# Altium schematic sheet 07_LMS7002M_1_Power.SchDoc: LMS7002M #1 power supply
size A3 portrait; Organization: Lime Microsystems; Address1: Surrey Tech Centre; Address2: Guildford GU2 7YG; Address3: Surrey; Address4: United Kingdom; Revision: v1.2; SheetNumber: 7; SheetTotal: 27; PageSetup: Record=PageOptions|CenterHorizontal=True|CenterVertical=True|PrintScale=0.70|XCorrection=1.00|YCorrection=1.00|PrintKind=1|BorderSize=5000000|LeftOffset=0|BottomOffset=0|Orientation=1|PaperLength=2970|PaperWidth=2100|Scale=100|PaperSource=7|PrintQuality=600|MediaType=1|DitherType=10|PrintScaleMode=1|PaperKind=A4|PaperIndex=9
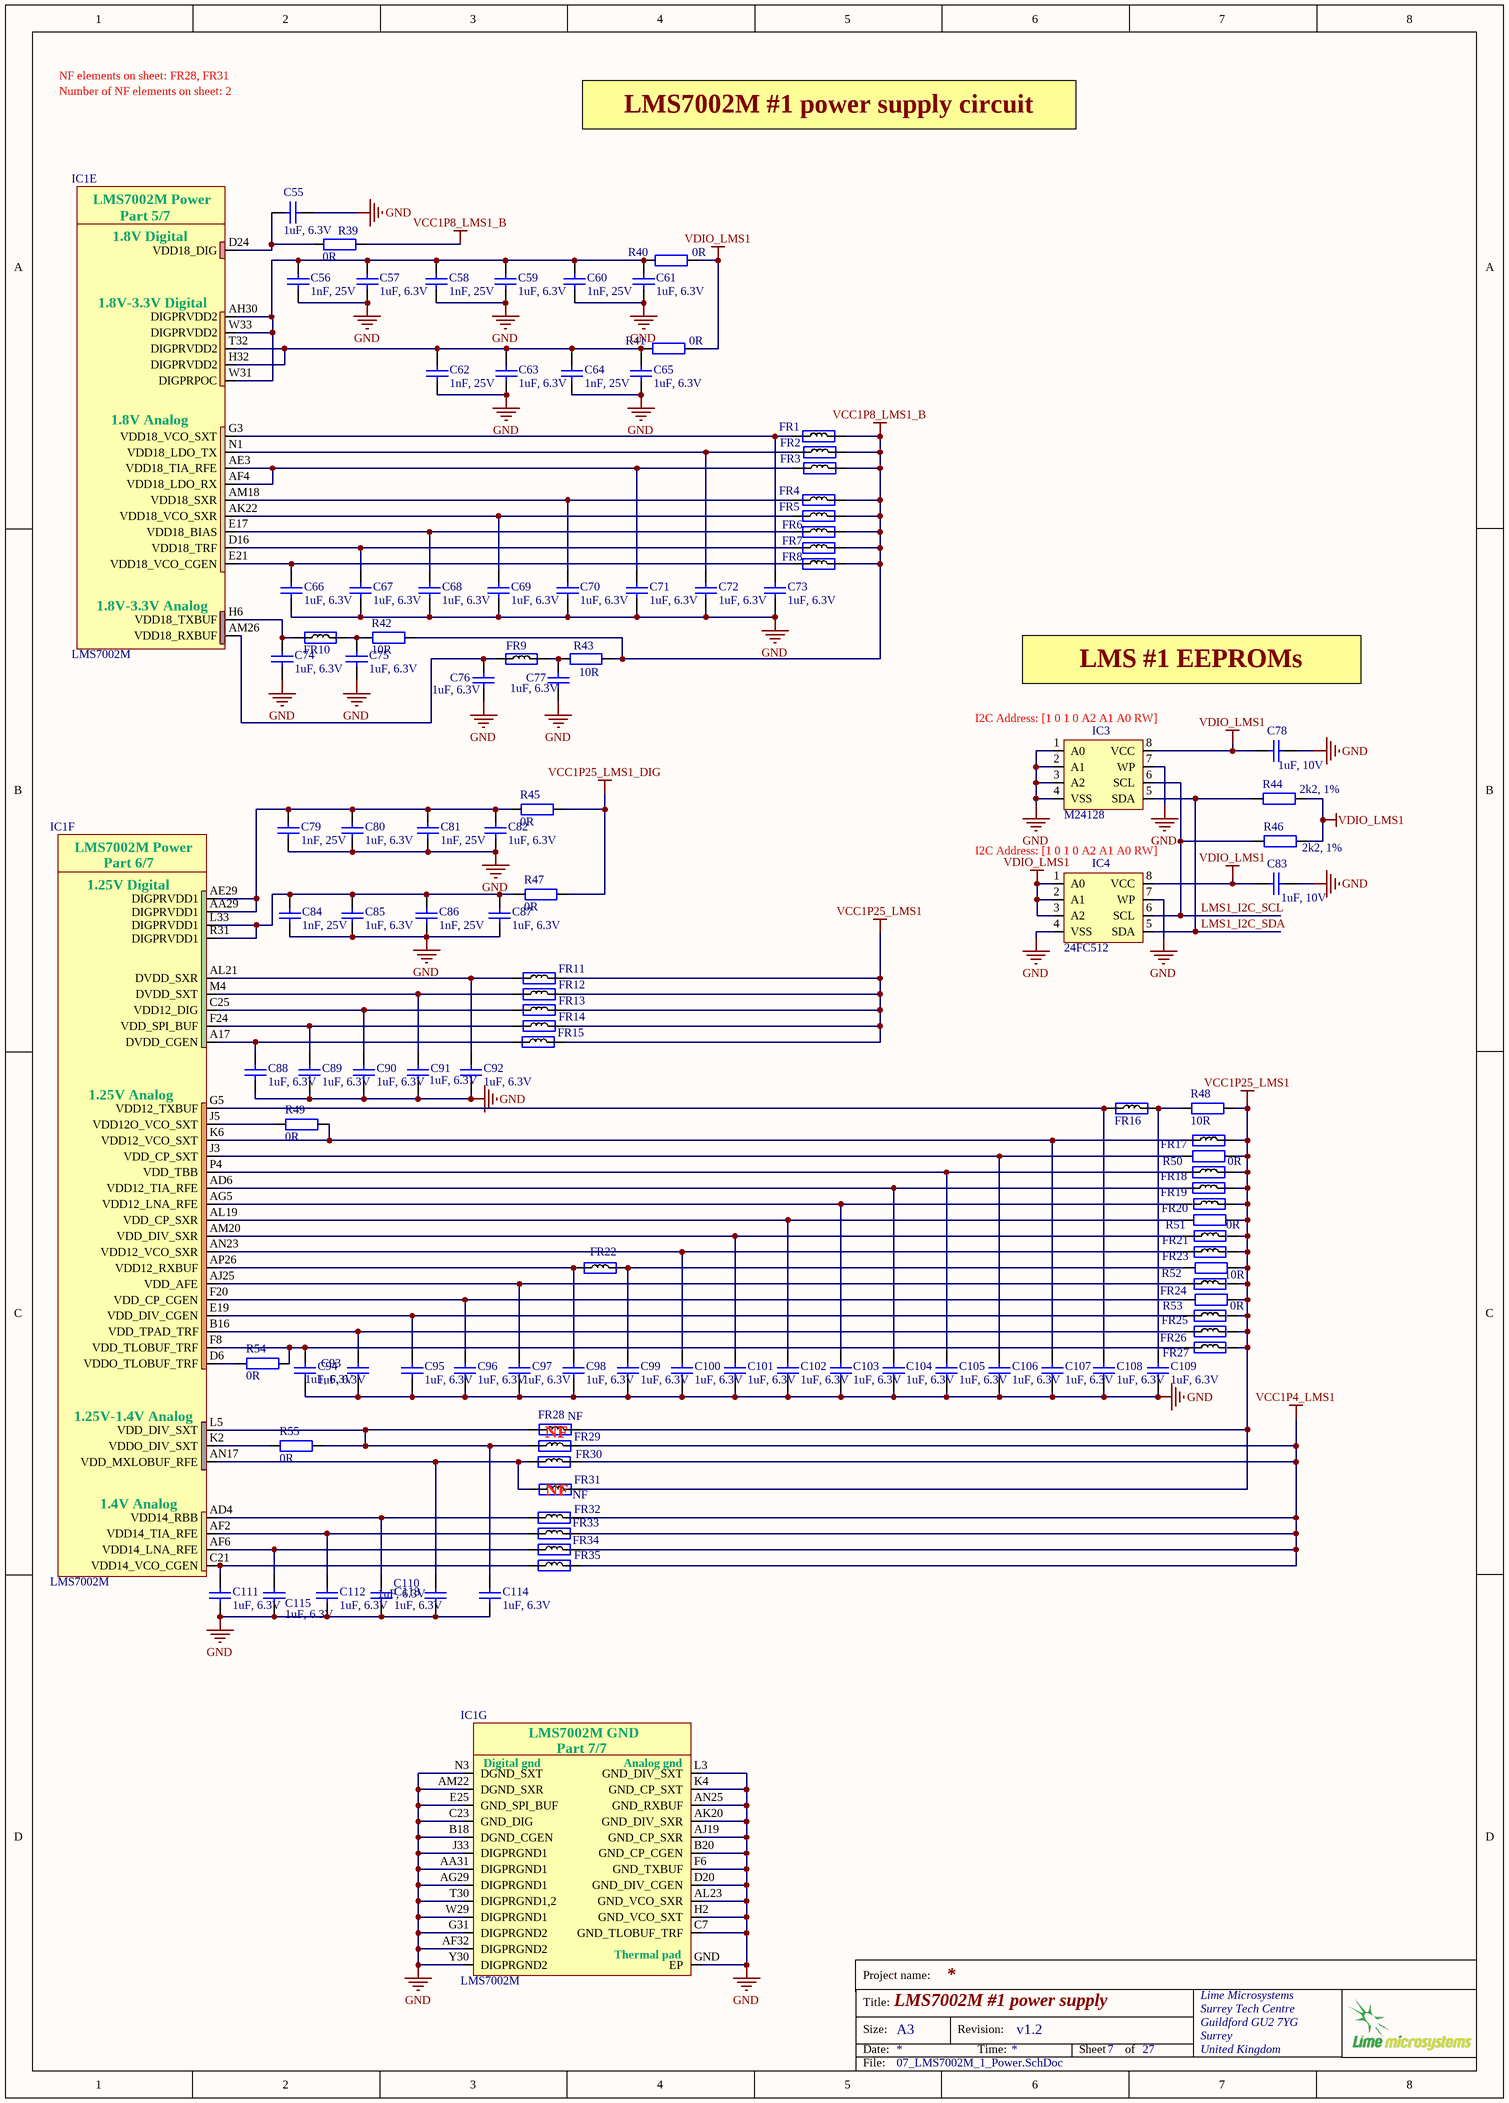
[diagram p0: 07_LMS7002M_1_Power.SchDoc]

## Parts
C55  1uF, 6.3V  [CAP0201]
C56  1nF, 25V  [CAP0201]
C57  1uF, 6.3V  [CAP0201]
C58  1nF, 25V  [CAP0201]
C59  1uF, 6.3V  [CAP0201]
C60  1nF, 25V  [CAP0201]
C61  1uF, 6.3V  [CAP0201]
C62  1nF, 25V  [CAP0201]
C63  1uF, 6.3V  [CAP0201]
C64  1nF, 25V  [CAP0201]
C65  1uF, 6.3V  [CAP0201]
C66  1uF, 6.3V  [CAP0201]
C67  1uF, 6.3V  [CAP0201]
C68  1uF, 6.3V  [CAP0201]
C69  1uF, 6.3V  [CAP0201]
C70  1uF, 6.3V  [CAP0201]
C71  1uF, 6.3V  [CAP0201]
C72  1uF, 6.3V  [CAP0201]
C73  1uF, 6.3V  [CAP0201]
C74  1uF, 6.3V  [CAP0201]
C75  1uF, 6.3V  [CAP0201]
C76  1uF, 6.3V  [CAP0201]
C77  1uF, 6.3V  [CAP0201]
C78  1uF, 10V  [CAP0402]
C79  1nF, 25V  [CAP0201]
C80  1uF, 6.3V  [CAP0201]
C81  1nF, 25V  [CAP0201]
C82  1uF, 6.3V  [CAP0201]
C83  1uF, 10V  [CAP0402]
C84  1nF, 25V  [CAP0201]
C85  1uF, 6.3V  [CAP0201]
C86  1nF, 25V  [CAP0201]
C87  1uF, 6.3V  [CAP0201]
C88  1uF, 6.3V  [CAP0201]
C89  1uF, 6.3V  [CAP0201]
C90  1uF, 6.3V  [CAP0201]
C91  1uF, 6.3V  [CAP0201]
C92  1uF, 6.3V  [CAP0201]
C93  1uF, 6.3V  [CAP0201]
C94  1uF, 6.3V  [CAP0201]
C95  1uF, 6.3V  [CAP0201]
C96  1uF, 6.3V  [CAP0201]
C97  1uF, 6.3V  [CAP0201]
C98  1uF, 6.3V  [CAP0201]
C99  1uF, 6.3V  [CAP0201]
C100  1uF, 6.3V  [CAP0201]
C101  1uF, 6.3V  [CAP0201]
C102  1uF, 6.3V  [CAP0201]
C103  1uF, 6.3V  [CAP0201]
C104  1uF, 6.3V  [CAP0201]
C105  1uF, 6.3V  [CAP0201]
C106  1uF, 6.3V  [CAP0201]
C107  1uF, 6.3V  [CAP0201]
C108  1uF, 6.3V  [CAP0201]
C109  1uF, 6.3V  [CAP0201]
C110  1uF, 6.3V  [CAP0201]
C111  1uF, 6.3V  [CAP0201]
C112  1uF, 6.3V  [CAP0201]
C113  1uF, 6.3V  [CAP0201]
C114  1uF, 6.3V  [CAP0201]
C115  1uF, 6.3V  [CAP0201]
FR1  Ferrite  [RES0201]  (value not drawn)
FR2  Ferrite  [RES0201]  (value not drawn)
FR3  Ferrite  [RES0201]  (value not drawn)
FR4  Ferrite  [RES0201]  (value not drawn)
FR5  Ferrite  [RES0201]  (value not drawn)
FR6  Ferrite  [RES0201]  (value not drawn)
FR7  Ferrite  [RES0201]  (value not drawn)
FR8  Ferrite  [RES0201]  (value not drawn)
FR9  Ferrite  [RES0201]  (value not drawn)
FR10  Ferrite  [RES0201]  (value not drawn)
FR11  Ferrite  [RES0201]  (value not drawn)
FR12  Ferrite  [RES0201]  (value not drawn)
FR13  Ferrite  [RES0201]  (value not drawn)
FR14  Ferrite  [RES0201]  (value not drawn)
FR15  Ferrite  [RES0201]  (value not drawn)
FR16  Ferrite  [RES0201]  (value not drawn)
FR17  Ferrite  [RES0201]  (value not drawn)
FR18  Ferrite  [RES0201]  (value not drawn)
FR19  Ferrite  [RES0201]  (value not drawn)
FR20  Ferrite  [RES0201]  (value not drawn)
FR21  Ferrite  [RES0201]  (value not drawn)
FR22  Ferrite  [RES0201]  (value not drawn)
FR23  Ferrite  [RES0201]  (value not drawn)
FR24  Ferrite  [RES0201]  (value not drawn)
FR25  Ferrite  [RES0201]  (value not drawn)
FR26  Ferrite  [RES0201]  (value not drawn)
FR27  Ferrite  [RES0201]  (value not drawn)
FR28  Assembly Info: NF  [RES0201]  (hidden comment: Ferrite)
FR29  Ferrite  [RES0201]  (value not drawn)
FR30  Ferrite  [RES0201]  (value not drawn)
FR31  Assembly Info: NF  [RES0201]  (hidden comment: Ferrite)
FR32  Ferrite  [RES0201]  (value not drawn)
FR33  Ferrite  [RES0201]  (value not drawn)
FR34  Ferrite  [RES0201]  (value not drawn)
FR35  Ferrite  [RES0201]  (value not drawn)
IC1  LMS7002M  [LMS7002M_v4]  (parts E,F,G of 7)
IC3  M24128  [24FC512]
IC4  24FC512  [24FC512]
R39  0R  [RES0201]
R40  0R  [RES0402]
R41  0R  [RES0402]
R42  10R  [RES0201]
R43  10R  [RES0201]
R44  2k2, 1%  [RES0402]
R45  0R  [RES0402]
R46  2k2, 1%  [RES0402]
R47  0R  [RES0402]
R48  10R  [RES0201]
R49  0R  [RES0201]
R50  0R  [RES0201]
R51  0R  [RES0201]
R52  10R  [RES0201]
R53  0R  [RES0201]
R54  0R  [RES0201]
R55  0R  [RES0201]

## Nets
GND: C55.2 C56.2 C57.2 C58.2 C59.2 C60.2 C61.2 C62.2 C63.2 C64.2 C65.2 C66.2 C67.2 C68.2 C69.2 C70.2 C71.2 C72.2 C73.2 C74.2 C75.2 C76.2 C77.2 C78.1 C79.2 C80.2 C81.2 C82.2 C83.1 C84.2 C85.2 C86.2 C87.2 C88.2 C89.2 C90.2 C91.2 C92.2 C93.2 C94.2 C95.2 C96.2 C97.2 C98.2 C99.2 C100.2 C101.2 C102.2 C103.2 C104.2 C105.2 C106.1 C107.1 C108.2 C109.2 C110.2 C111.2 C112.2 C113.2 C114.2 C115.2 IC1.AA31(DIGPRGND1) IC1.AF32(DIGPRGND2) IC1.AG29(DIGPRGND1) IC1.AJ19(GND_CP_SXR) IC1.AK20(GND_DIV_SXR) IC1.AL23(GND_VCO_SXR) IC1.AM22(DGND_SXR) IC1.AN25(GND_RXBUF) IC1.B18(DGND_CGEN) IC1.B20(GND_CP_CGEN) IC1.C7(GND_TLOBUF_TRF) IC1.C23(GND_DIG) IC1.D20(GND_DIV_CGEN) IC1.E25(GND_SPI_BUF) IC1.F6(GND_TXBUF) IC1.G31(DIGPRGND2) IC1.GND(EP) IC1.H2(GND_VCO_SXT) IC1.J33(DIGPRGND1) IC1.K4(GND_CP_SXT) IC1.L3(GND_DIV_SXT) IC1.N3(DGND_SXT) IC1.T30(DIGPRGND1,2) IC1.W29(DIGPRGND1) IC1.Y30(DIGPRGND2) IC3.1(A0) IC3.2(A1) IC3.3(A2) IC3.4(VSS) IC3.7(WP) IC4.4(VSS) IC4.7(WP)
VCC1P4_LMS1: FR29.1 FR30.2 FR32.2 FR33.2 FR34.2 FR35.2
VCC1P8_LMS1_B: FR1.2 FR2.1 FR3.1 FR4.2 FR5.2 FR6.2 FR7.2 FR8.2 R39.2 R42.2 R43.1
VCC1P25_LMS1: FR11.1 FR12.1 FR13.1 FR14.1 FR15.2 FR17.1 FR18.1 FR19.1 FR20.1 FR21.2 FR23.2 FR24.2 FR25.2 FR26.2 FR27.2 FR28.1 FR31.2 R48.2 R50.2 R51.1 R52.1 R53.1
VCC1P25_LMS1_DIG: R45.2 R47.2
VDIO_LMS1: C78.2 C83.2 IC3.8(VCC) IC4.1(A0) IC4.2(A1) IC4.3(A2) IC4.8(VCC) R40.1 R41.1 R44.1 R46.1
LMS1_I2C_SCL: IC3.6(SCL) IC4.6(SCL) R46.2
LMS1_I2C_SDA: IC3.5(SDA) IC4.5(SDA) R44.2
NetC55_1: C55.1 IC1.D24(VDD18_DIG) R39.1
NetC56_1: C56.1 C57.1 C58.1 C59.1 C60.1 C61.1 IC1.AH30(DIGPRVDD2) IC1.W31(DIGPRPOC) IC1.W33(DIGPRVDD2) R40.2
NetC62_1: C62.1 C63.1 C64.1 C65.1 IC1.H32(DIGPRVDD2) IC1.T32(DIGPRVDD2) R41.2
NetC66_1: C66.1 FR8.1 IC1.E21(VDD18_VCO_CGEN)
NetC67_1: C67.1 FR7.1 IC1.D16(VDD18_TRF)
NetC68_1: C68.1 FR6.1 IC1.E17(VDD18_BIAS)
NetC69_1: C69.1 FR5.1 IC1.AK22(VDD18_VCO_SXR)
NetC70_1: C70.1 FR4.1 IC1.AM18(VDD18_SXR)
NetC71_1: C71.1 FR3.2 IC1.AE3(VDD18_TIA_RFE) IC1.AF4(VDD18_LDO_RX)
NetC72_1: C72.1 FR2.2 IC1.N1(VDD18_LDO_TX)
NetC73_1: C73.1 FR1.1 IC1.G3(VDD18_VCO_SXT)
NetC74_1: C74.1 FR10.2 IC1.H6(VDD18_TXBUF)
NetC75_1: C75.1 FR10.1 R42.1
NetC76_1: C76.1 FR9.1 IC1.AM26(VDD18_RXBUF)
NetC77_1: C77.1 FR9.2 R43.2
NetC79_1: C79.1 C80.1 C81.1 C82.1 IC1.AA29(DIGPRVDD1) IC1.AE29(DIGPRVDD1) R45.1
NetC84_1: C84.1 C85.1 C86.1 C87.1 IC1.L33(DIGPRVDD1) IC1.R31(DIGPRVDD1) R47.1
NetC88_1: C88.1 FR15.1 IC1.A17(DVDD_CGEN)
NetC89_1: C89.1 FR14.2 IC1.F24(VDD_SPI_BUF)
NetC90_1: C90.1 FR13.2 IC1.C25(VDD12_DIG)
NetC91_1: C91.1 FR12.2 IC1.M4(DVDD_SXT)
NetC92_1: C92.1 FR11.2 IC1.AL21(DVDD_SXR)
NetC93_1: C93.1 FR26.1 IC1.B16(VDD_TPAD_TRF)
NetC94_1: C94.1 FR27.1 IC1.F8(VDD_TLOBUF_TRF) R54.1
NetC95_1: C95.1 FR25.1 IC1.E19(VDD_DIV_CGEN)
NetC96_1: C96.1 IC1.F20(VDD_CP_CGEN) R53.2
NetC97_1: C97.1 FR24.1 IC1.AJ25(VDD_AFE)
NetC98_1: C98.1 FR22.1 IC1.AP26(VDD12_RXBUF)
NetC99_1: C99.1 FR22.2 R52.2
NetC100_1: C100.1 FR23.1 IC1.AN23(VDD12_VCO_SXR)
NetC101_1: C101.1 FR21.1 IC1.AM20(VDD_DIV_SXR)
NetC102_1: C102.1 IC1.AL19(VDD_CP_SXR) R51.2
NetC103_1: C103.1 FR20.2 IC1.AG5(VDD12_LNA_RFE)
NetC104_1: C104.1 FR19.2 IC1.AD6(VDD12_TIA_RFE)
NetC105_1: C105.1 FR18.2 IC1.P4(VDD_TBB)
NetC106_2: C106.2 IC1.J3(VDD_CP_SXT) R50.1
NetC107_2: C107.2 FR17.2 IC1.K6(VDD12_VCO_SXT) R49.2
NetC108_1: C108.1 FR16.2 IC1.G5(VDD12_TXBUF)
NetC109_1: C109.1 FR16.1 R48.1
NetC110_1: C110.1 FR30.1 FR31.1 IC1.AN17(VDD_MXLOBUF_RFE)
NetC111_1: C111.1 FR35.1 IC1.C21(VDD14_VCO_CGEN)
NetC112_1: C112.1 FR33.1 IC1.AF2(VDD14_TIA_RFE)
NetC113_1: C113.1 FR32.1 IC1.AD4(VDD14_RBB)
NetC114_1: C114.1 FR28.2 FR29.2 IC1.L5(VDD_DIV_SXT) R55.2
NetC115_1: C115.1 FR34.1 IC1.AF6(VDD14_LNA_RFE)
NetIC1_D6: IC1.D6(VDDO_TLOBUF_TRF) R54.2
NetIC1_J5: IC1.J5(VDD12O_VCO_SXT) R49.1
NetIC1_K2: IC1.K2(VDDO_DIV_SXT) R55.1

## Notes on the sheet
- NF elements on sheet: FR28, FR31
- Number of NF elements on sheet: 2
- LMS7002M #1 power supply circuit
- LMS #1 EEPROMs
- (near IC3) I2C Address: [1 0 1 0 A2 A1 A0 RW]
- (near IC4) I2C Address: [1 0 1 0 A2 A1 A0 RW]
- (near FR28) NF
- (near FR31) NF
- Project name:
- Title:
- Size:
- Date:
- A3
- Revision:
- Time:
- Sheet
- of
- File:
- (in symbol LMS7002Mr3, part E) LMS7002M Power; Part 5/7; 1.8V Digital; 1.8V-3.3V Digital; 1.8V Analog; 1.8V-3.3V Analog
- (in symbol LMS7002Mr3, part F) LMS7002M Power; Part 6/7; 1.25V Digital; 1.25V Analog; 1.25V-1.4V Analog; 1.4V Analog
- (in symbol LMS7002Mr3, part G) LMS7002M GND; Part 7/7; Digital gnd; Analog gnd; Thermal pad

## Library data of the parts
C55 C57 C59 C61 C63 C65-C77 C80 C82 C85 C87-C115 = Cap_0402: Manufacturer: TDK Corporation; Manufacturer Part Number 1: C0603X5R0J105M030BC; Part Description: 1µF ±20% 6.3V Ceramic Capacitor X5R 0201 (0603 Metric); Tolerance: ±20%; Capacitance: 1.0µF; Temperature Coefficient: X5R; Value: 1uF, 6.3V; Supplier 1: Digi-Key; Supplier Part Number 1: 445-8008-1-ND; Applications: General Purpose; Features: -; Lead Style: -; Ratings: -; Thickness (Max): -; Lead Spacing: -; Height - Seated (Max): -; Size / Dimension: 0.024" L x 0.012" W (0.60mm x 0.30mm); Mounting Type: Surface Mount, MLCC; Operating Temperature: -55°C ~ 85°C; Package / Case: 0201 (0603 Metric); Packaging: Cut Tape (CT); Voltage - Rated: 6.3V; Category: Capacitors; RoHS: RoHS Compliant
C56 C58 C60 C62 C64 C79 C81 C84 C86 = Cap_0402: Manufacturer Part Number 1: C0603X7R1E102K030BA; Manufacturer: TDK Corporation; Part Description: 1000pF ±10% 25V Ceramic Capacitor X7R 0201 (0603 Metric); Temperature Coefficient: X7R; Tolerance: ±10%; Capacitance: 1000pF; Value: 1nF, 25V; Supplier 1: Digi-Key; Supplier Part Number 1: 445-7275-1-ND; Voltage - Rated: 25V; Features: -; Package / Case: 0201 (0603 Metric); Lead Spacing: -; Mounting Type: Surface Mount, MLCC; Lead Style: -; Height - Seated (Max): -; Operating Temperature: -55°C ~ 125°C; Size / Dimension: 0.024" L x 0.012" W (0.60mm x 0.30mm); Applications: General Purpose; Ratings: -; Thickness (Max): 0.013" (0.33mm); RoHS: RoHS Compliant; Packaging: Cut Tape (CT); Category: Capacitors
C78 C83 = Cap_0402: Manufacturer Part Number 1: GRM155R61A105KE15J; Manufacturer: TDK; Part Description: 1µF ±10% 10V Ceramic Capacitor X5R 0402 (1005 Metric); Voltage Rating: 10; Capacitance Tolerance: ± 10%; Product Range: TDK - C Series; Ceramic Capacitor Case: 0402 [1005 Metric]; Capacitance: 1; Dielectric Characteristic: X6; Value: 1uF, 10V; Supplier 1: Newark; Supplier Part Number 1: 490-6298-2-ND; MSL: -; RoHS: YES
FR1-FR35 = Ferrite: Manufacturer Part Number 1: BK0603TS601-T; Manufacturer: Taiyo Yuden; Part Description: FERRITE BEAD 600 OHM 0201 1LN; DC Resistance (DCR): 750 mOhm Max; Filter Type: Differential Mode - Single; Impedance @ Frequency: 600 Ohm @ 100MHz; Current Rating: 270mA; Value: 600R@100MHz; Supplier 1: Digi-Key; Supplier Part Number 1: 587-3277-1-ND; Size / Dimension: 0.024" L x 0.012" W (0.60mm x 0.30mm); Package / Case: 0201 (0603 Metric); Height (Max): 0.013" (0.33mm); Mounting Type: Surface Mount; Packaging: Cut Tape (CT); RoHS: RoHS Compliant; Category: Filters
IC1 = LMS7002Mr3: Schematic symbol revision 3. Default footprint - 0.31mm pad; Manufacturer: Lime Microsystems; Part Description: IC FPRF Transceiver LMS7002M; 261 pin aQFN; Supplier 1: Lime Microsystems; Supplier Part Number 1: LMS7002M; Manufacturer Part Number 1: LMS7002M
IC3 = 24FC64F: Part Description: IC EEPROM 128KBIT 1MHZ 8TSSOP; Manufacturer: STMicroelectronics; Manufacturer Part Number 1: M24128-DRDW8TP/K; Format - Memory: EEPROMs - Serial; Memory Type: EEPROM; Memory Size: 128K (16K x 8); Speed: 1MHz; Interface: I²C, 2-Wire Serial; Voltage - Supply: 1.8 V ~ 5.5 V; Supplier 1: Digi-Key; Supplier Part Number 1: 497-15336-1-ND; RoHS: RoHS Compliant; Category: Integrated Circuits (ICs); Stock 1: 1677; Pricing 1: 1=0.47, 10=0.464, 100=0.3805, 500=0.36996, 1000=0.36005 (USD); Packaging: Cut Tape (CT); Part Status: Active; Operating Temperature: -40°C ~ 105°C (TA); Package / Case: 8-TSSOP (0.173", 4.40mm Width); Supplier Device Package: 8-TSSOP; ComponentLink1URL: http://www.st.com/content/ccc/resource/technical/document/datasheet/5c/f3/4b/70/8e/63/48/95/DM00149696.pdf/files/DM00149696.pdf/jcr:content/translations/en.DM00149696.pdf; ComponentLink1Description: http://www.st.com/content/ccc/resource/technical/document/datasheet/5c/f3/4b/70/8e/63/48/95/DM00149696.pdf/files/DM00149696.pdf/jcr:content/translations/en.DM00149696.pdf
IC4 = 24FC512: Manufacturer Part Number 1: 24FC512-I/ST; Manufacturer: Microchip Technology; Part Description: IC EEPROM 512KBIT 1MHZ 8TSSOP; Speed: 400kHz, 1MHz; Memory Type: EEPROM; Memory Size: 512K (64K x 8); Voltage - Supply: 1.7 V ~ 5.5 V; Interface: I²C, 2-Wire Serial; Format - Memory: EEPROMs - Serial; Supplier 1: Digi-Key; RoHS: RoHS Compliant; Packaging: Tube; Operating Temperature: -40°C ~ 85°C; Supplier Device Package: 8-TSSOP; Category: Integrated Circuits (ICs); Package / Case: 8-TSSOP (0.173", 4.40mm Width); Supplier Part Number 1: 24FC512-I/ST-ND
R39 R49-R51 R53-R55 = Res_0402: Manufacturer Part Number 1: MCR006YRTJ000; Manufacturer: Rohm Semiconductor; Part Description: RES SMD 0.0OHM JUMPER 1/20W 0201; Resistance (Ohms): 0.0; Power (Watts): 0.05W, 1/20W; Tolerance: Jumper; Value: 0R; Supplier 1: Digi-Key; Supplier Part Number 1: RHM0.0CCCT-ND; Number of Terminations: 2; Operating Temperature: -55°C ~ 125°C; Package / Case: 0201 (0603 Metric); Height: 0.010" (0.26mm); Supplier Device Package: 0201 (0603 Metric); Size / Dimension: 0.024" L x 0.012" W (0.60mm x 0.30mm); Temperature Coefficient: -; Category: Resistors; Features: -; RoHS: RoHS Compliant; Composition: Thick Film; Packaging: Cut Tape (CT)
R40 R41 R45 R47 = Res_0402: Manufacturer Part Number 1: RC0402JR-070RL; Manufacturer: Yageo; Part Description: RES SMD 0.0OHM JUMPER 1/16W 0402; Resistance (Ohms): 0.0; Tolerance: Jumper; Power (Watts): 0.063W, 1/16W; Value: 0R; Supplier 1: Digi-Key; Supplier Part Number 1: 311-0.0JRTR-ND; Category: Resistors; Temperature Coefficient: -; Features: Moisture Resistant; Supplier Device Package: 0402; Height: 0.016" (0.40mm); Package / Case: 0402 (1005 Metric); Operating Temperature: -55°C ~ 155°C; Size / Dimension: 0.039" L x 0.020" W (1.00mm x 0.50mm); Composition: Thick Film; Packaging: Tape & Reel (TR); Number of Terminations: 2; RoHS: RoHS Compliant
R42 R43 R48 R52 = Res_0402: Manufacturer: Panasonic Electronic Components; Part Description: RES SMD 10 OHM 1% 1/20W 0201; Manufacturer Part Number 1: ERJ-1GEF10R0C; Power (Watts): 0.05W, 1/20W; Resistance (Ohms): 10; Tolerance: ±1%; Temperature Coefficient: ±200ppm/°C; Value: 10R; Supplier 1: Digi-Key; Supplier Part Number 1: P10.0ABCT-ND; Package / Case: 0201 (0603 Metric); Height: 0.010" (0.26mm); Supplier Device Package: 0201; Packaging: Cut Tape (CT); Composition: Thick Film; Category: Resistors; Number of Terminations: 2; Size / Dimension: 0.024" L x 0.012" W (0.60mm x 0.30mm); Operating Temperature: -55°C ~ 125°C; Features: -; RoHS: RoHS Compliant
R44 R46 = Res_0402: Manufacturer: Stackpole Electronics Inc; Manufacturer Part Number 1: RMCF0402FT2K20; Part Description: RES SMD 2.2K OHM 1% 1/16W 0402; Resistance (Ohms): 2.2k; Temperature Coefficient: ±100ppm/°C; Power (Watts): 0.063W, 1/16W; Value: 2k2, 1%; Supplier 1: Digi-Key; Supplier Part Number 1: RMCF0402FT2K20CT-ND; Supplier Device Package: 0402; Package / Case: 0402 (1005 Metric); Size / Dimension: 0.039" L x 0.020" W (1.00mm x 0.50mm); Operating Temperature: -55°C ~ 155°C; Composition: Thick Film; Category: Resistors; Features: -; Height: 0.016" (0.40mm); RoHS: RoHS Compliant; Number of Terminations: 2; Packaging: Cut Tape (CT); Tolerance: ±1%